# Altium schematic sheet TK525_HVDC.SchDoc: TK525 HVDC
size A3; Author: Øystein Smith; Organization: Omega Verksted; DocumentNumber: 15; Revision: 0; SheetNumber: 3; SheetTotal: 3
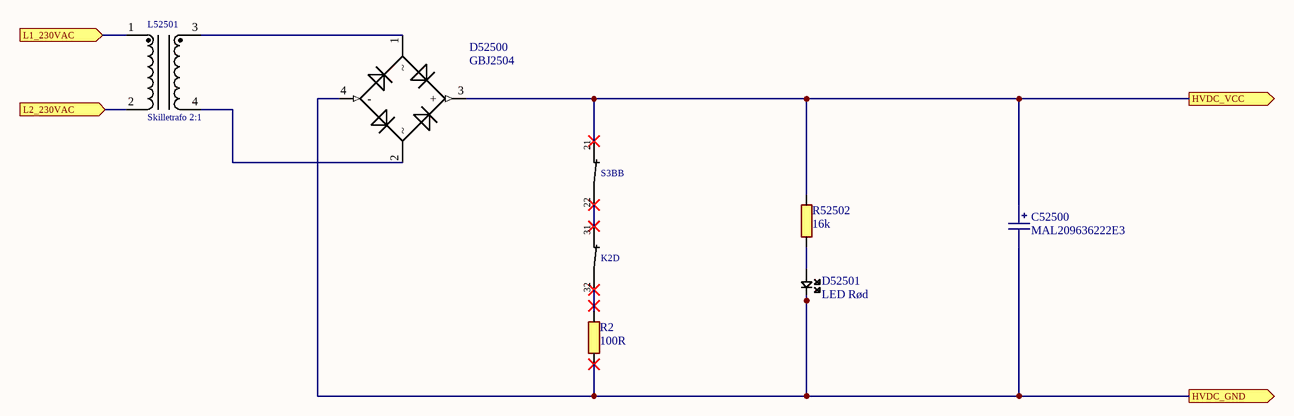
[diagram p0: TK525_HVDC.SchDoc]

## Parts
C52500  MAL209636222E3  [dummy]
D52500  GBJ2504  [dummy]
D52501  LED Rød  [LED254W7L870D500]
K2  Kontaktor  [dummy]  (value not drawn)  (part D of 6)
L52501  Skilletrafo 2:1  [dummy]
R2  100R  [dummy]
R52502  16k  [RESA_0.25W]
S3B  Automasjonsbryter NC  [dummy]  (value not drawn)  (part B of 3)

## Ports
HVDC_GND (out), HVDC_VCC (out), L1_230VAC (in), L2_230VAC (in)

## Nets
HVDC_GND: C52500.1 D52500.4(-) D52501.2 R2.1 ; port HVDC_GND
HVDC_VCC: C52500.2 D52500.3(+) R52502.2 S3B.21 ; port HVDC_VCC
L1_230VAC: L52501.1 ; port L1_230VAC
L2_230VAC: L52501.2 ; port L2_230VAC
NetD52500_1: D52500.1 L52501.3
NetD52500_2: D52500.2 L52501.4
NetD52501_1: D52501.1 R52502.1
NetK2_31: K2.31 S3B.22
NetK2_32: K2.32 R2.2

## Notes on the sheet
- Size:
- Date:
- Title:
- A3
- Revision:
- Sheet
- of
- Author:
- File:

## Library data of the parts
C52500 = 3076: CAP, ALU ELEC, 2200UF, 400V; id: 3076; symbol_opprettet_av: 815; leverandor_varenr: 2342176; pris: 340; nokkelord: Capacitor, Kondensator; produsent: Vishay; leverandor: Farnell; pakketype: TH; komponenttype: 2; symbol_opprettet: 28/06/2014 15:26:13; navn: MAL209636222E3; pakke_opprettet_av: 815; pakke_opprettet: 02/11/2021 00:12:53
D52500 = 3322: diodebro/Likeretterbro 400V 25A; id: 3322; rad: 7; rom: OV; lager_type: Baklager; dybde: 0; antall: 43; symbol_opprettet_av: 815; leverandor_varenr: 1651042; pris: 16; nokkelord: bro, diodebro, bridge; leverandor: Farnell; pakketype: TH; komponenttype: 9; hylle: 7; symbol_opprettet: 09/06/2015 22:09:39; navn: GBJ2504; pakke_opprettet_av: 815; pakke_opprettet: 02/11/2021 00:12:53
D52501 = 3117: Farget LED, 5mm; id: 3117; rad: 6; rom: OV; lager_type: Fremlager; dybde: 0; hylle: 4; antall: 59; pakke_opprettet_av: 1366; symbol_opprettet_av: 815; pris: 1; nokkelord: LED, rød, red, 5mm, diode, lys, light,  led 5mm; komponenttype: 9; pakke_opprettet: 09/02/2016 18:21:00; symbol_opprettet: 06/07/2014 18:59:47; navn: LED Rød; produsent: -; pakketype: -
K2 = 2948: Industriellt rele; id: 2948; symbol_opprettet_av: 815; leverandor_varenr: 9940480; pris: 300; produsent: IMO; leverandor: Farnell; symbol_opprettet: 04/07/2015 12:23:41; navn: Kontaktor; nokkelord: Contactor; pakketype: -; pakke_opprettet_av: 815; pakke_opprettet: 02/11/2021 00:12:53
L52501 = 3842: Skilletrafo Ringkjerne; rad: 4; rom: OV; lager_type: Fremlager; dybde: 0; hylle: 2; antall: 40; pakke_opprettet_av: 815; pris: 1900; nokkelord: Trafo, transformer; produsent: Hammond; id: 3842; leverandor_varenr: 2546942; leverandor: Farnell; komponenttype: 3; navn: Skilletrafo 2:1; kolonne: 4; pakke_opprettet: 02/11/2021 00:12:53; symbol_opprettet_av: 815; symbol_opprettet: 30/04/2016 00:07:18; pakketype: -
R2 = 6251: 100 Ohm, 100W Resistor, Solder Lug, Wirewound +-5% 1.9kV; id: 6251; symbol_opprettet_av: 815; leverandor_varenr: 1768214; pris: 250; nokkelord: Motstand, resistor, 100, tesla, effekt, effektmotstand, power, lampe; produsent: TT electronics; leverandor: Farnell; komponenttype: 1; symbol_opprettet: 08/07/2014 21:16:33; navn: 100R; pakke_opprettet_av: 815; pakke_opprettet: 02/11/2021 00:12:53
R52502 = 3759: 0.25W 1% Generic resistor; id: 3759; rad: 7; rom: OV; lager_type: Fremlager; dybde: 1; hylle: 5; antall: 99; pakke_opprettet_av: 815; pris: 0; nokkelord: Motstand, Resistor; pakketype: TH; pakke_opprettet: 28/06/2014 17:13:33; symbol_opprettet_av: 815; symbol_opprettet: 08/07/2014 21:16:33; navn: 16k; komponenttype: 1
S3B = 6256: Contact Block, SPST-NC, 10 A, 500 V, 1 Pole, 3SU Series, Screw; id: 6256; symbol_opprettet_av: 815; leverandor_varenr: 2695772; pris: 80; nokkelord: bryter, switch, tesla; produsent: Siemens; leverandor: Farnell; symbol_opprettet: 01/11/2021 23:45:21; navn: Automasjonsbryter NC; pakke_opprettet_av: 815; pakke_opprettet: 02/11/2021 00:12:53